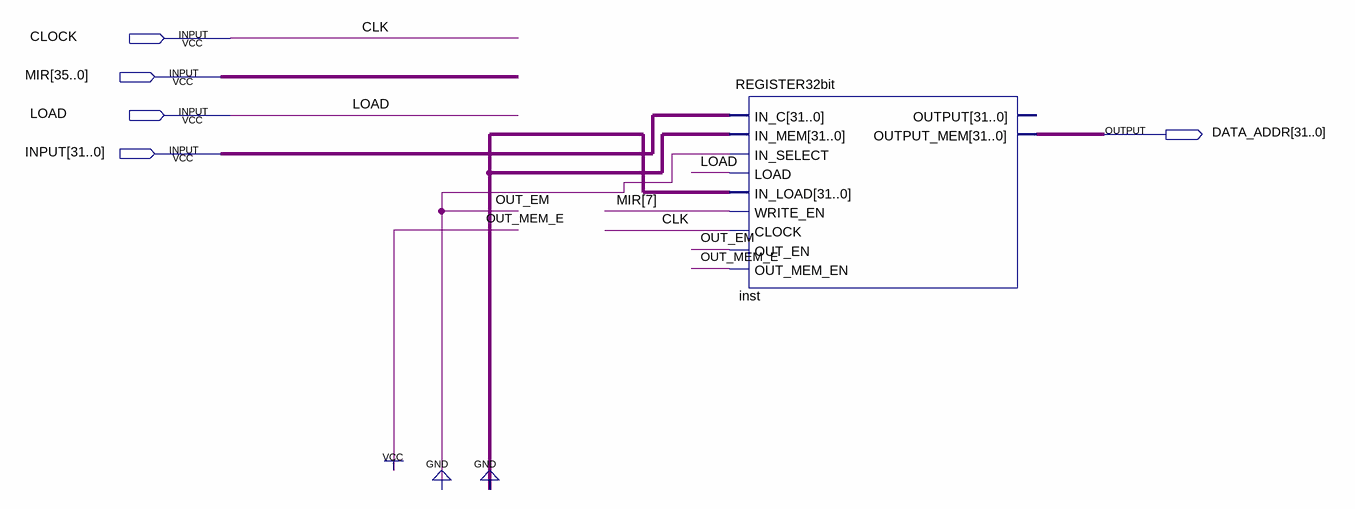
[diagram p0: schematic sheet]
// Quartus schematic MAR.bdf as structural Verilog: 1 symbols, 5 pins
module MAR (
  input  CLOCK,
  input  [35:0] MIR,
  input  LOAD,
  input  [31:0] INPUT,
  output [31:0] DATA_ADDR
);

  REGISTER32bit inst (
    .IN_C(INPUT), .IN_MEM({32{1'b0}}), .IN_SELECT(1'b0), .LOAD(LOAD), .IN_LOAD({32{1'b0}}),
    .WRITE_EN(MIR[7]), .CLOCK(CLOCK), .OUT_EN(1'b0), .OUT_MEM_EN(1'b1), .OUTPUT_MEM(DATA_ADDR));  // open: OUTPUT

  // Other names for the same wires on the sheet: CLK = CLOCK
endmodule
